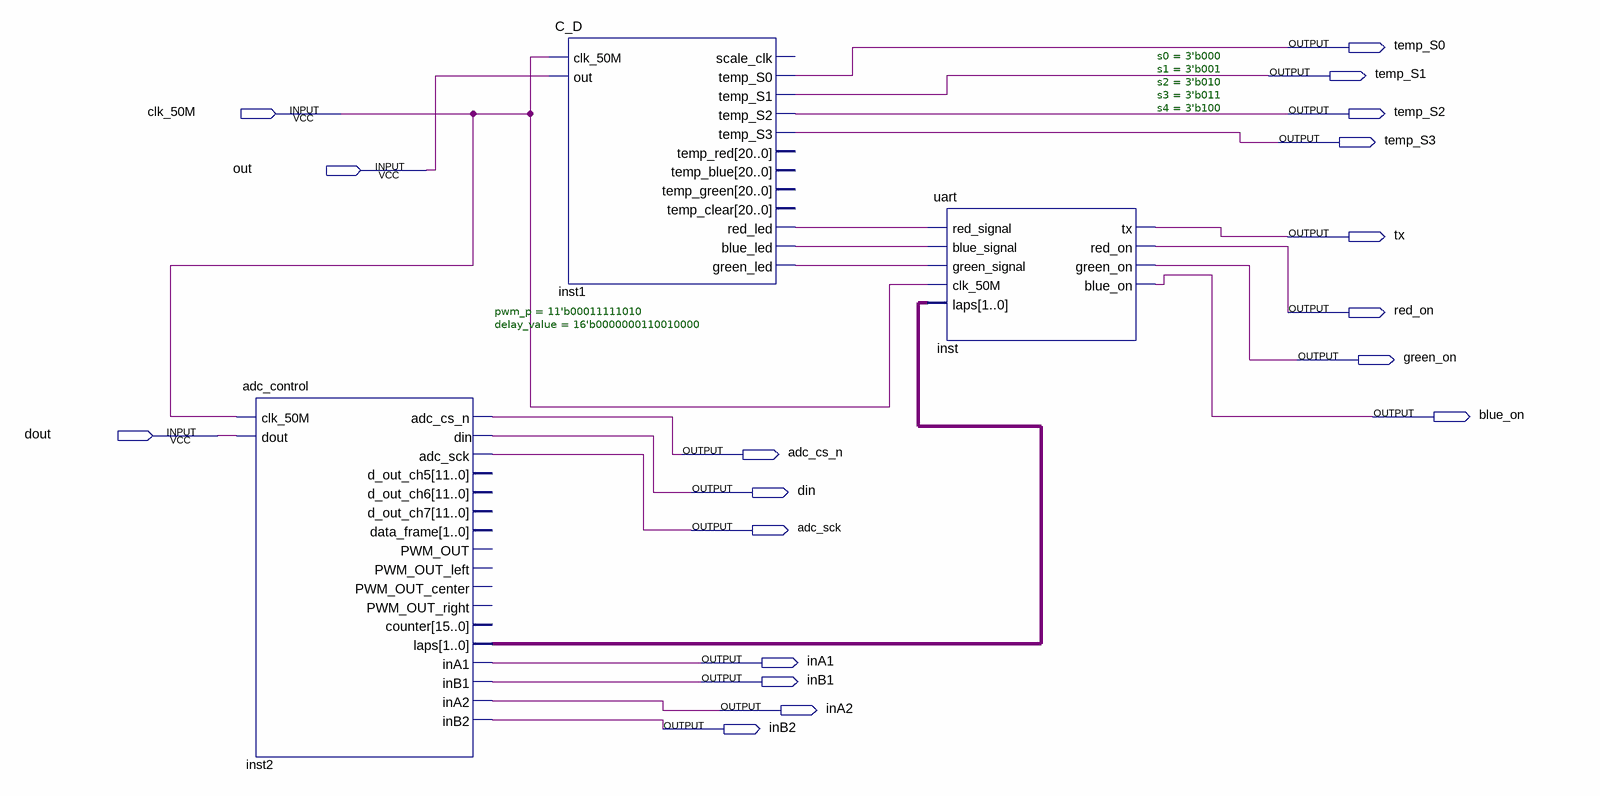
[diagram p0: schematic sheet]
// Quartus schematic cs1.bdf as structural Verilog: 3 symbols, 18 pins
module cs1 (
  input  clk_50M,
  input  out,
  input  dout,
  output temp_S0,
  output temp_S1,
  output temp_S2,
  output temp_S3,
  output tx,
  output red_on,
  output green_on,
  output blue_on,
  output adc_cs_n,
  output din,
  output adc_sck,
  output inA1,
  output inB1,
  output inA2,
  output inB2
);

  wire inst1_blue_led, inst1_green_led, inst1_red_led;
  wire [1:0] inst2_laps;

  adc_control #(.pwm_p(11'b00011111010), .delay_value(16'b0000000110010000)) inst2 (
    .clk_50M(clk_50M), .dout(dout), .adc_cs_n(adc_cs_n), .din(din), .adc_sck(adc_sck), .laps(inst2_laps),
    .inA1(inA1), .inB1(inB1), .inA2(inA2), .inB2(inB2));  // open: d_out_ch5, d_out_ch6, d_out_ch7, data_frame, PWM_OUT, PWM_OUT_left, PWM_OUT_center, PWM_OUT_right, counter
  C_D inst1 (
    .clk_50M(clk_50M), .out(out), .temp_S0(temp_S0), .temp_S1(temp_S1), .temp_S2(temp_S2), .temp_S3(temp_S3),
    .red_led(inst1_red_led), .blue_led(inst1_blue_led), .green_led(inst1_green_led));  // open: scale_clk, temp_red, temp_blue, temp_green, temp_clear
  uart #(.s0(3'b000), .s1(3'b001), .s2(3'b010), .s3(3'b011), .s4(3'b100)) inst (
    .red_signal(inst1_red_led), .blue_signal(inst1_blue_led), .green_signal(inst1_green_led),
    .clk_50M(clk_50M), .laps(inst2_laps), .tx(tx), .red_on(red_on), .green_on(green_on), .blue_on(blue_on));
endmodule
